# Altium schematic sheet ES1050.SchDoc
size A4; SheetNumber: 1; SheetTotal: 1
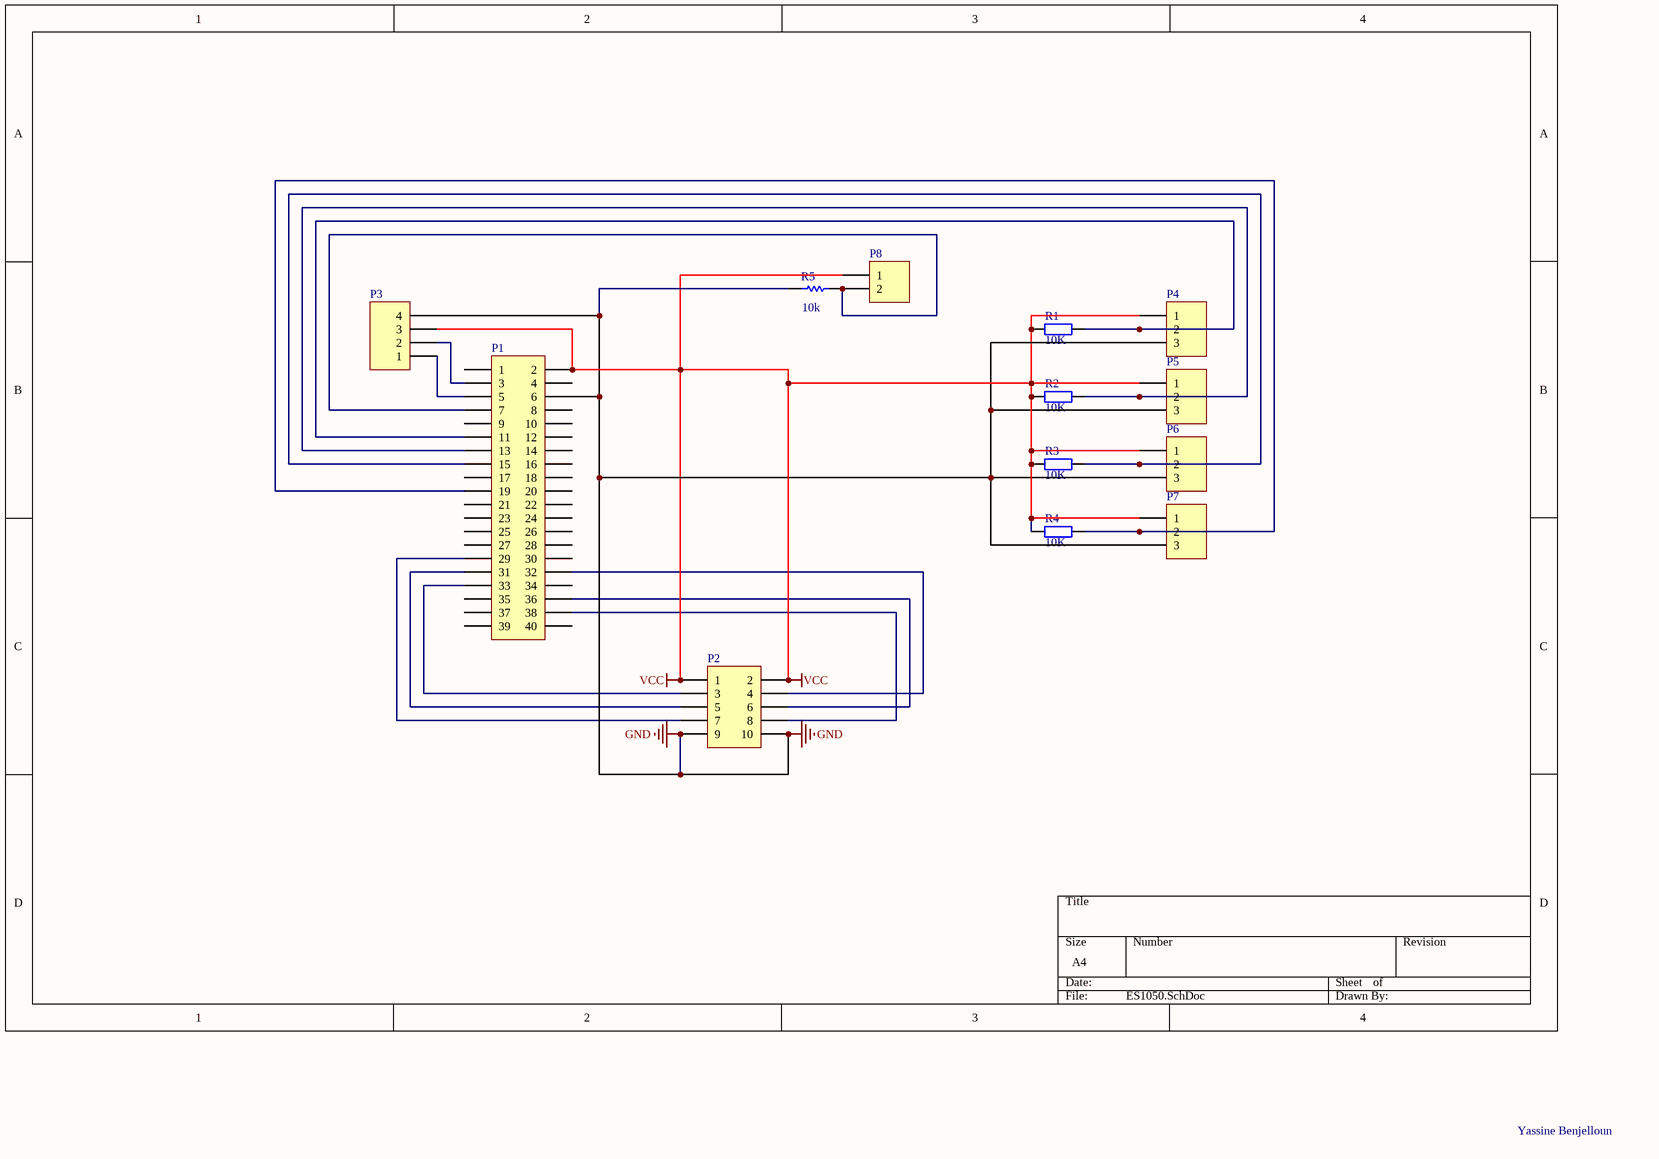
[diagram p0: ES1050.SchDoc]

## Parts
P1  Header 20X2  [HDR2X20]  (value not drawn)
P2  Header 5X2  [HDR2X5]  (value not drawn)
P3  Header 4H  [HDR1X4H]  (value not drawn)
P4  Header 3  [HDR1X3]  (value not drawn)
P5  Header 3  [HDR1X3]  (value not drawn)
P6  Header 3  [HDR1X3]  (value not drawn)
P7  Header 3  [HDR1X3]  (value not drawn)
P8  Header 2  [HDR1X2]  (value not drawn)
R1  value 10K  [AXIAL-0.4]  (hidden comment: Res2)
R2  value 10K  [AXIAL-0.4]  (hidden comment: Res2)
R3  value 10K  [AXIAL-0.4]  (hidden comment: Res2)
R4  value 10K  [AXIAL-0.4]  (hidden comment: Res2)
R5  value 10k  [AXIAL-0.4]  (hidden comment: Res2)

## Nets
GND: P1.6 P2.9 P2.10 P3.4 P4.3 P5.3 P6.3 P7.3 R5.1
VCC: P1.2 P2.1 P2.2 P3.3 P4.1 P5.1 P6.1 P7.1 P8.1 R1.1 R2.1 R3.1 R4.1
NetP1_3: P1.3 P3.2
NetP1_5: P1.5 P3.1
NetP1_7: P1.7 P8.2 R5.2
NetP1_11: P1.11 P4.2 R1.2
NetP1_13: P1.13 P5.2 R2.2
NetP1_15: P1.15 P6.2 R3.2
NetP1_19: P1.19 P7.2 R4.2
NetP1_29: P1.29 P2.7
NetP1_31: P1.31 P2.5
NetP1_32: P1.32 P2.4
NetP1_33: P1.33 P2.3
NetP1_36: P1.36 P2.6
NetP1_38: P1.38 P2.8

Not connected (* = marked no-connect by the designer): P1 1 4 8 9 10 12 14 16 17 18 20 21 22 23 24 25 26 27 28 30 34 35 37 39 40

## Notes on the sheet
- Yassine Benjelloun

## Library data of the parts
P1 = Header 20X2: Header, 20-Pin, Dual row; LatestRevisionDate: 17-Jul-2002; LatestRevisionNote: Re-released for DXP Platform.; Publisher: Altium Limited; Supplier 1: Digi-Key; Supplier Part Number 1: S7123-ND
P2 = Header 5X2: Header, 5-Pin, Dual row; LatestRevisionDate: 17-Jul-2002; LatestRevisionNote: Re-released for DXP Platform.; Publisher: Altium Limited; Supplier 1: Digi-Key; Supplier Part Number 1: S7108-ND
P3 = Header 4H: Header, 4-Pin, Right Angle; LatestRevisionDate: 17-Jul-2002; LatestRevisionNote: Re-released for DXP Platform.; Publisher: Altium Limited; Supplier 1: Digi-Key; Supplier Part Number 1: S5440-ND
P4-P7 = Header 3: Header, 3-Pin; LatestRevisionDate: 17-Jul-2002; LatestRevisionNote: Re-released for DXP Platform.; Publisher: Altium Limited
  P5-P7: Supplier 1: Digi-Key; Supplier Part Number 1: S7036-ND
P8 = Header 2: Header, 2-Pin; LatestRevisionDate: 17-Jul-2002; LatestRevisionNote: Re-released for DXP Platform.; Publisher: Altium Limited; Supplier 1: Digi-Key; Supplier Part Number 1: S7000-ND
R1-R4 = Res2: Resistor; Published: 8-Jun-2000; LatestRevisionDate: 17-Jul-2002; LatestRevisionNote: Re-released for DXP Platform.; PackageReference: AXIAL-0.4; Publisher: Altium Limited; PackageDescription: Axial Device, Thru-Hole; 2 Leads; 0.4 in Pin Spacing; Supplier 1: Digi-Key; Supplier Part Number 1: A105970CT-ND
R5 = Res1: Resistor; Published: 8-Jun-2000; LatestRevisionDate: 17-Jul-2002; LatestRevisionNote: Re-released for DXP Platform.; PackageReference: AXIAL-0.3; Publisher: Altium Limited; PackageDescription: Axial Device, Thru-Hole; 2 Leads; 0.3 in Pin Spacing; Supplier 1: Digi-Key; Supplier Part Number 1: ALSR3J-450-ND